# Altium project PCB_Project_IMX7.PrjPCB (part 5 of 9)

## Sheet IMX7S_CONNECTORS_&_IHM.SchDoc
size A2
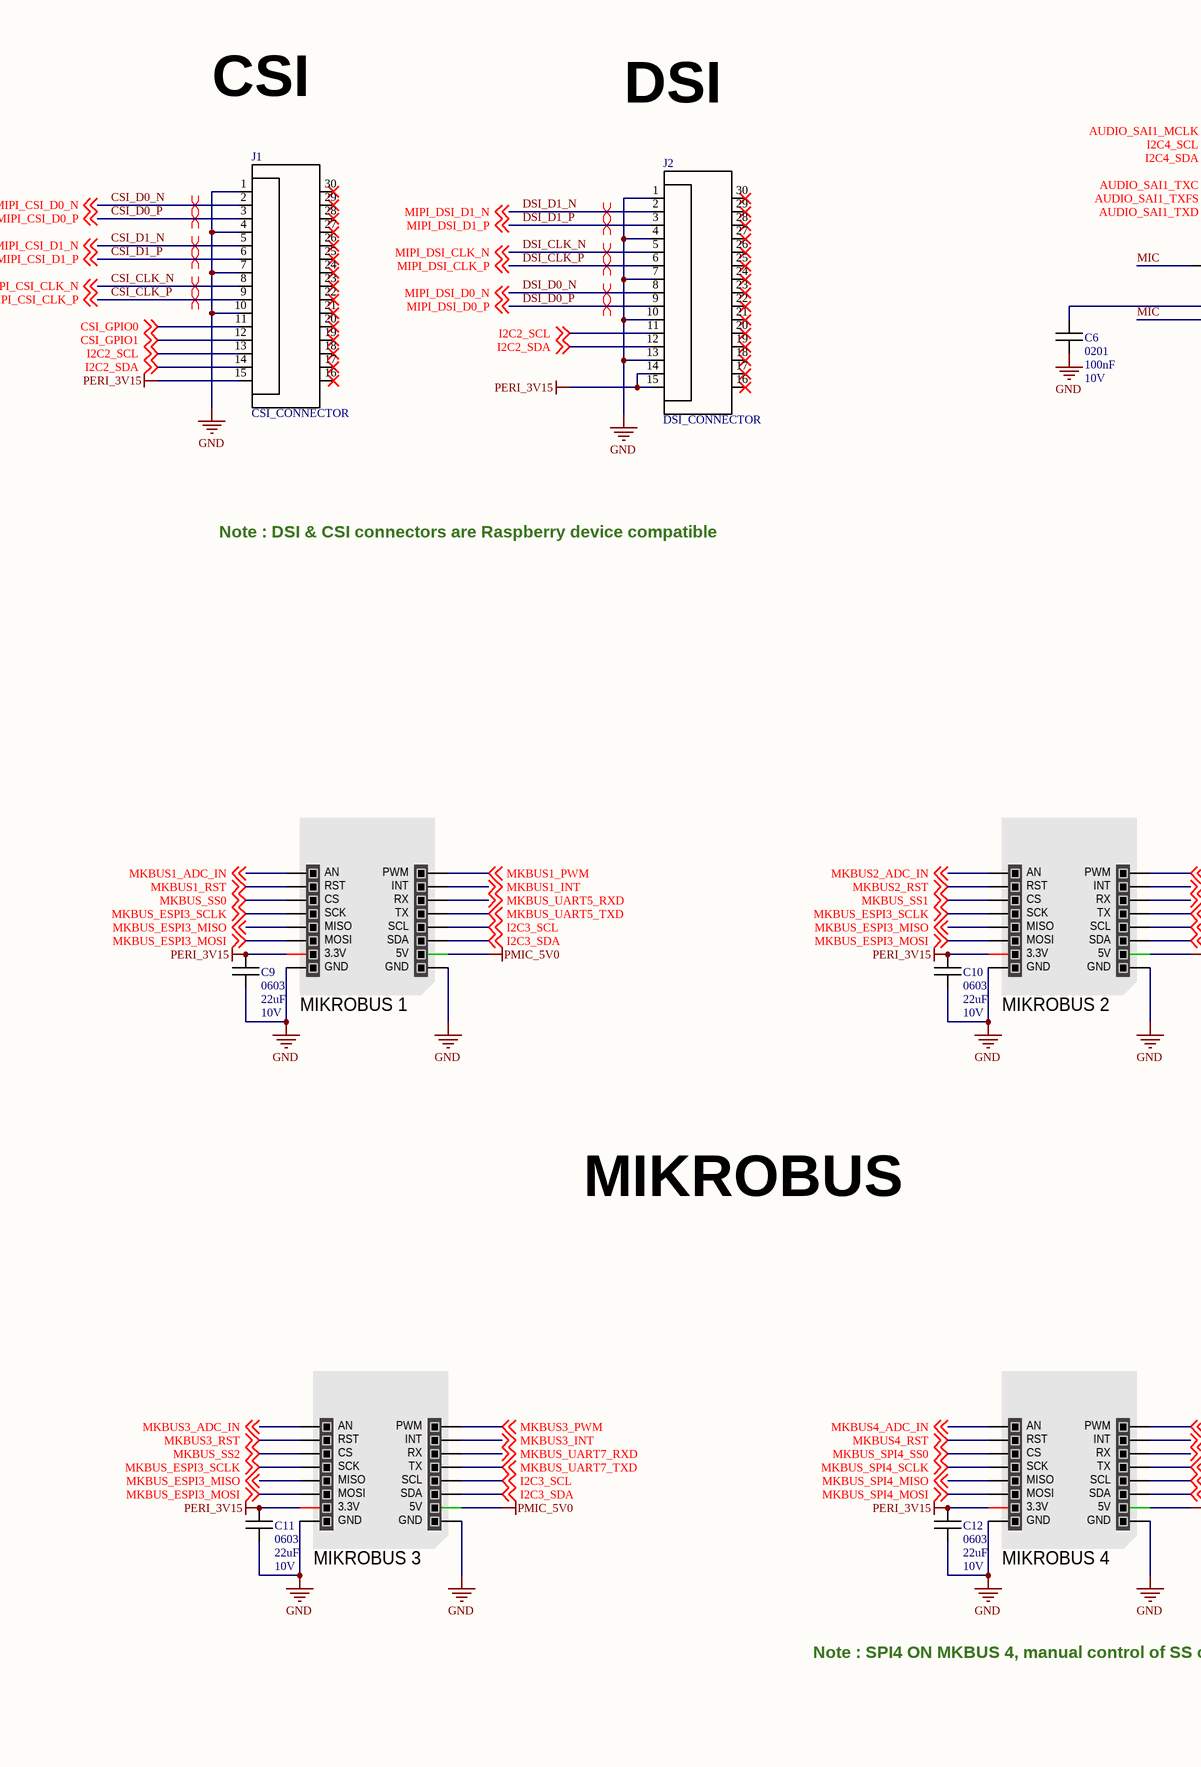
[diagram p7: IMX7S_CONNECTORS_&_IHM.SchDoc, left]
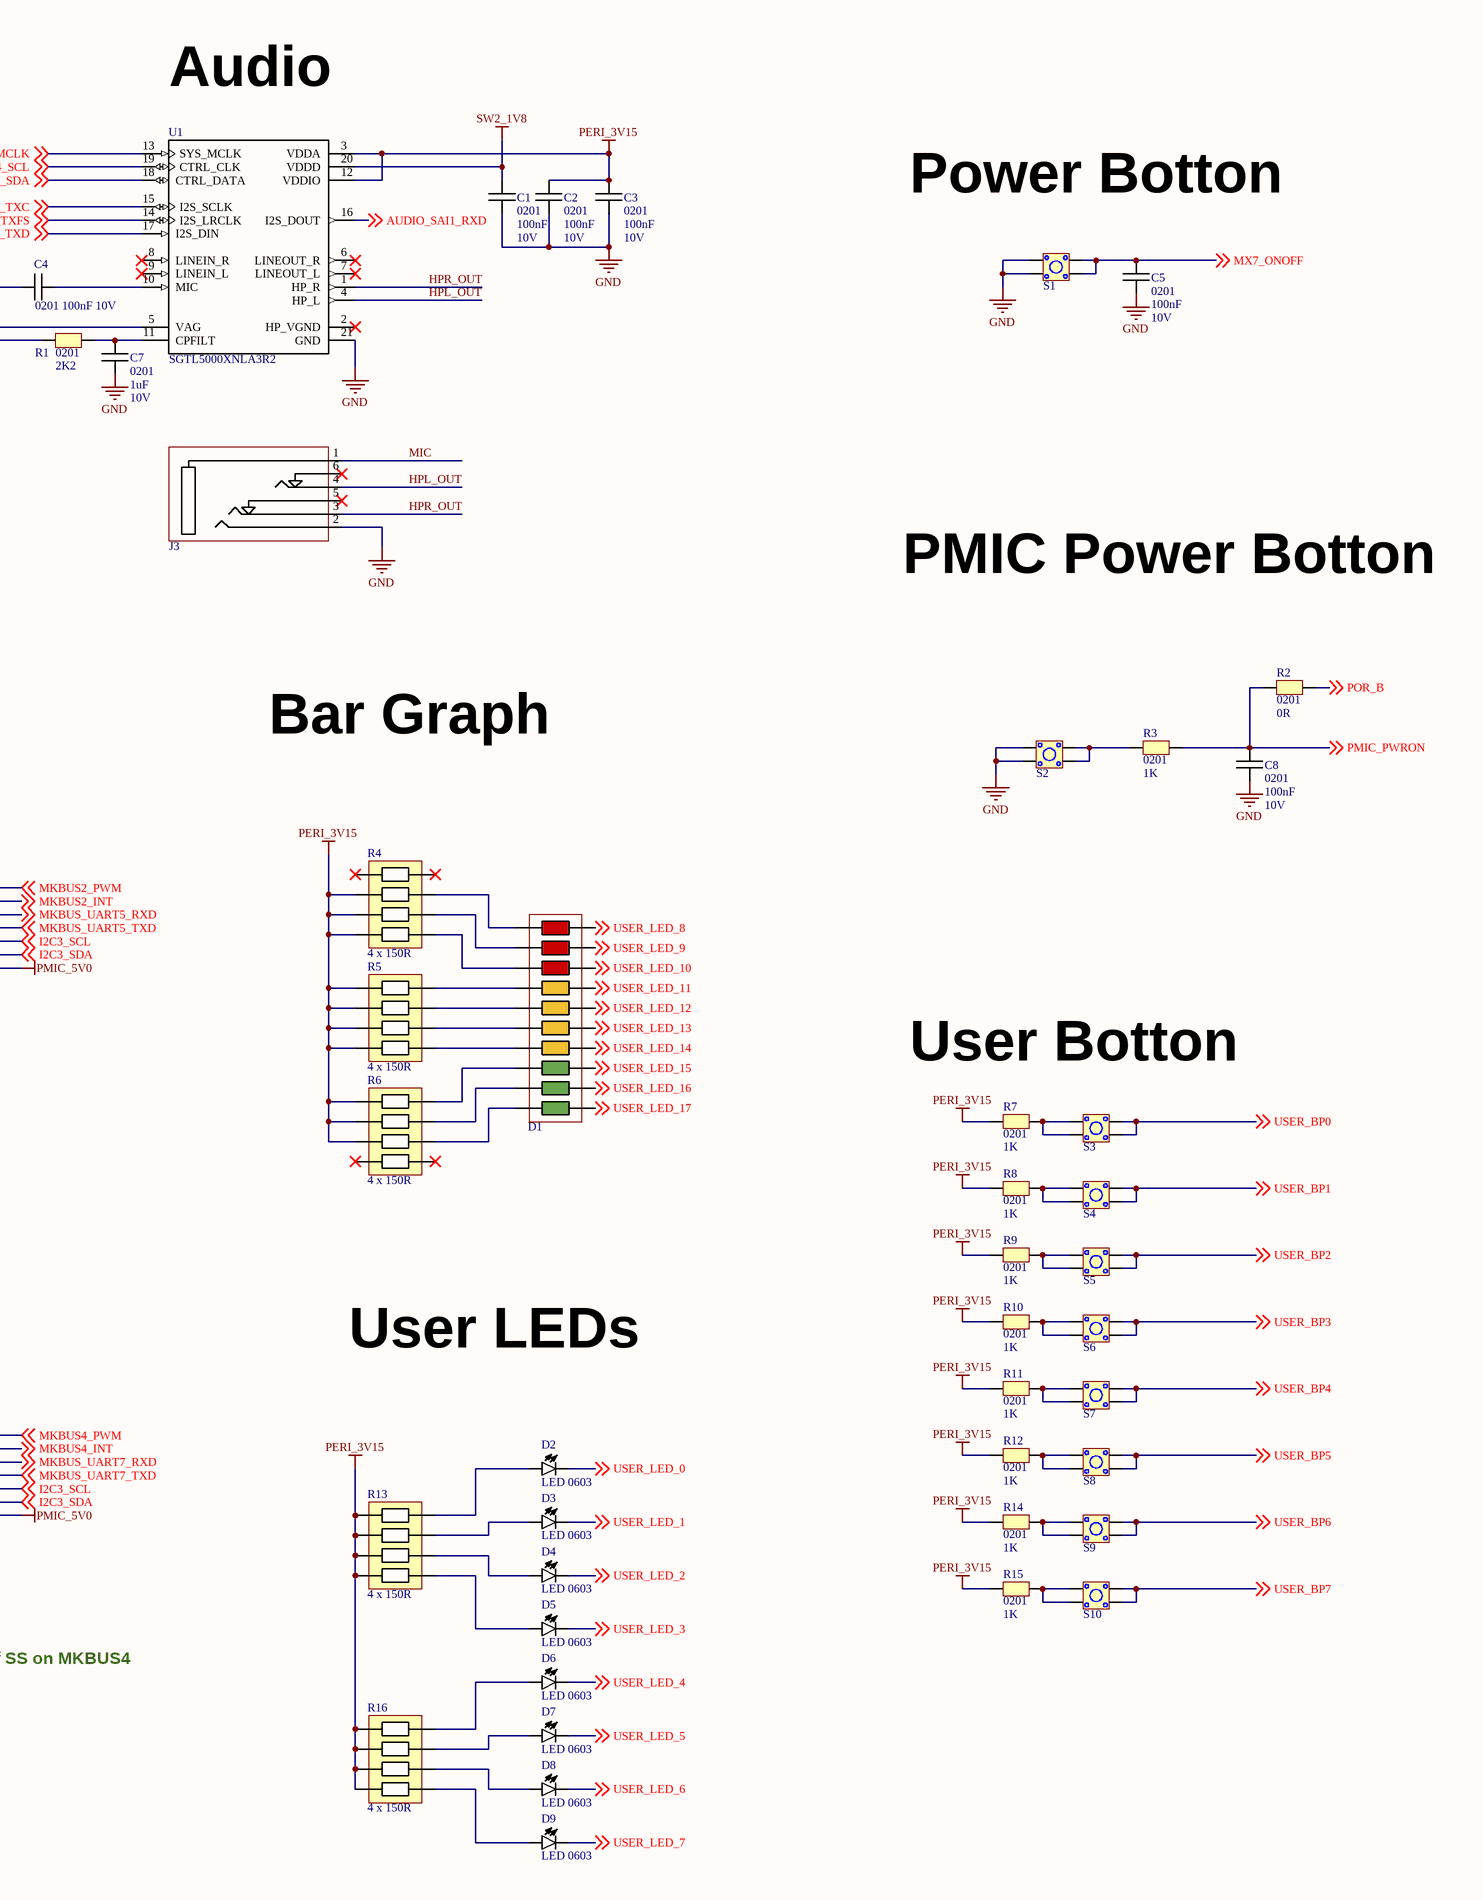
[diagram p8: IMX7S_CONNECTORS_&_IHM.SchDoc, right]

### Parts
C1  value 100nF  PACKAGE: 0201  VOLTAGE: 10V  [C0201]  (hidden comment: C0201)
C2  value 100nF  PACKAGE: 0201  VOLTAGE: 10V  [C0201]  (hidden comment: C0201)
C3  value 100nF  PACKAGE: 0201  VOLTAGE: 10V  [C0201]  (hidden comment: C0201)
C4  value 100nF  PACKAGE: 0201  VOLTAGE: 10V  [C0201]  (hidden comment: C0201)
C5  value 100nF  PACKAGE: 0201  VOLTAGE: 10V  [C0201]  (hidden comment: C0201)
C6  value 100nF  PACKAGE: 0201  VOLTAGE: 10V  [C0201]  (hidden comment: C0201)
C7  value 1uF  PACKAGE: 0201  VOLTAGE: 10V  [C0201]  (hidden comment: C0201)
C8  value 100nF  PACKAGE: 0201  VOLTAGE: 10V  [C0201]  (hidden comment: C0201)
C9  value 22uF  PACKAGE: 0603  VOLTAGE: 10V  [C0603]  (hidden comment: C0603)
C10  value 22uF  PACKAGE: 0603  VOLTAGE: 10V  [C0603]  (hidden comment: C0603)
C11  value 22uF  PACKAGE: 0603  VOLTAGE: 10V  [C0603]  (hidden comment: C0603)
C12  value 22uF  PACKAGE: 0603  VOLTAGE: 10V  [C0603]  (hidden comment: C0603)
D1  BARGRAPH  [BARGRAPH]  (value not drawn)
D2  LED 0603  [D0603]
D3  LED 0603  [D0603]
D4  LED 0603  [D0603]
D5  LED 0603  [D0603]
D6  LED 0603  [D0603]
D7  LED 0603  [D0603]
D8  LED 0603  [D0603]
D9  LED 0603  [D0603]
J1  CSI_CONNECTOR  [CSI_DSI]
J2  DSI_CONNECTOR  [CSI_DSI]
J3  JACK_AUDIO  [JACK_AUDIO]  (value not drawn)
MIKROBUS_1  MIKROBUS HOST CONN.  [MIKROBUS HOST CONN.]  (value not drawn)
MIKROBUS_2  MIKROBUS HOST CONN.  [MIKROBUS HOST CONN.]  (value not drawn)
MIKROBUS_3  MIKROBUS HOST CONN.  [MIKROBUS HOST CONN.]  (value not drawn)
MIKROBUS_4  MIKROBUS HOST CONN.  [MIKROBUS HOST CONN.]  (value not drawn)
R1  value 2K2  PACKAGE: 0201  [R0201]  (hidden comment: R0201)
R2  value 0R  PACKAGE: 0201  [R0201]  (hidden comment: R0201)
R3  value 1K  PACKAGE: 0201  [R0201]  (hidden comment: R0201)
R4  4 x 150R  [Reseau_R_1206]
R5  4 x 150R  [Reseau_R_1206]
R6  4 x 150R  [Reseau_R_1206]
R7  value 1K  PACKAGE: 0201  [R0201]  (hidden comment: R0201)
R8  value 1K  PACKAGE: 0201  [R0201]  (hidden comment: R0201)
R9  value 1K  PACKAGE: 0201  [R0201]  (hidden comment: R0201)
R10  value 1K  PACKAGE: 0201  [R0201]  (hidden comment: R0201)
R11  value 1K  PACKAGE: 0201  [R0201]  (hidden comment: R0201)
R12  value 1K  PACKAGE: 0201  [R0201]  (hidden comment: R0201)
R13  4 x 150R  [Reseau_R_1206]
R14  value 1K  PACKAGE: 0201  [R0201]  (hidden comment: R0201)
R15  value 1K  PACKAGE: 0201  [R0201]  (hidden comment: R0201)
R16  4 x 150R  [Reseau_R_1206]
S1  BP  [BP]  (value not drawn)
S2  BP  [BP]  (value not drawn)
S3  BP  [BP]  (value not drawn)
S4  BP  [BP]  (value not drawn)
S5  BP  [BP]  (value not drawn)
S6  BP  [BP]  (value not drawn)
S7  BP  [BP]  (value not drawn)
S8  BP  [BP]  (value not drawn)
S9  BP  [BP]  (value not drawn)
S10  BP  [BP]  (value not drawn)
U1  SGTL5000XNLA3R2  [QFN40P300X300X60-21N]

### Nets
GND: C1.1 C2.1 C3.1 C5.1 C6.1 C7.1 C8.1 C9.1 C10.1 C11.1 C12.1 J1.1 J1.4 J1.7 J1.10 J2.1 J2.4 J2.7 J2.10 J2.13 J3.2 MIKROBUS_1.8(GND) MIKROBUS_1.9(GND) MIKROBUS_2.8(GND) MIKROBUS_2.9(GND) MIKROBUS_3.8(GND) MIKROBUS_3.9(GND) MIKROBUS_4.8(GND) MIKROBUS_4.9(GND) S1.1 S1.2 S2.1 S2.2 U1.21(GND)
PERI_3V15: C2.2 C3.2 C9.2 C10.2 C11.2 C12.2 J1.15 J2.14 J2.15 MIKROBUS_1.7(3.3V) MIKROBUS_2.7(3.3V) MIKROBUS_3.7(3.3V) MIKROBUS_4.7(3.3V) R4.2 R4.3 R4.4 R5.1 R5.2 R5.3 R5.4 R6.1 R6.2 R6.3 R7.1 R8.1 R9.1 R10.1 R11.1 R12.1 R13.1 R13.2 R13.3 R13.4 R14.1 R15.1 R16.1 R16.2 R16.3 R16.4 U1.3(VDDA) U1.12(VDDIO)
PMIC_5V0: MIKROBUS_1.10(5V) MIKROBUS_2.10(5V) MIKROBUS_3.10(5V) MIKROBUS_4.10(5V)
SW2_1V8: C1.2 U1.20(VDDD)
AUDIO_SAI1_MCLK: U1.13(SYS_MCLK) ; off-sheet AUDIO_SAI1_MCLK
AUDIO_SAI1_RXD: U1.16(I2S_DOUT) ; off-sheet AUDIO_SAI1_RXD
AUDIO_SAI1_TXC: U1.15(I2S_SCLK) ; off-sheet AUDIO_SAI1_TXC
AUDIO_SAI1_TXD: U1.17(I2S_DIN) ; off-sheet AUDIO_SAI1_TXD
AUDIO_SAI1_TXFS: U1.14(I2S_LRCLK) ; off-sheet AUDIO_SAI1_TXFS
CSI_CLK_N: J1.8 ; off-sheet MIPI_CSI_CLK_N  [also labelled MIPI_CSI_CLK_N]
CSI_CLK_P: J1.9 ; off-sheet MIPI_CSI_CLK_P  [also labelled MIPI_CSI_CLK_P]
CSI_D0_N: J1.2 ; off-sheet MIPI_CSI_D0_N  [also labelled MIPI_CSI_D0_N]
CSI_D0_P: J1.3 ; off-sheet MIPI_CSI_D0_P  [also labelled MIPI_CSI_D0_P]
CSI_D1_N: J1.5 ; off-sheet MIPI_CSI_D1_N  [also labelled MIPI_CSI_D1_N]
CSI_D1_P: J1.6 ; off-sheet MIPI_CSI_D1_P  [also labelled MIPI_CSI_D1_P]
CSI_GPIO0: J1.11 ; off-sheet CSI_GPIO0
CSI_GPIO1: J1.12 ; off-sheet CSI_GPIO1
DSI_CLK_N: J2.5 ; off-sheet MIPI_DSI_CLK_N  [also labelled MIPI_DSI_CLK_N]
DSI_CLK_P: J2.6 ; off-sheet MIPI_DSI_CLK_P  [also labelled MIPI_DSI_CLK_P]
DSI_D0_N: J2.8 ; off-sheet MIPI_DSI_D0_N  [also labelled MIPI_DSI_D0_N]
DSI_D0_P: J2.9 ; off-sheet MIPI_DSI_D0_P  [also labelled MIPI_DSI_D0_P]
DSI_D1_N: J2.2 ; off-sheet MIPI_DSI_D1_N  [also labelled MIPI_DSI_D1_N]
DSI_D1_P: J2.3 ; off-sheet MIPI_DSI_D1_P  [also labelled MIPI_DSI_D1_P]
HPL_OUT: J3.4 U1.4(HP_L)
HPR_OUT: J3.3 U1.1(HP_R)
I2C2_SCL: J1.13 J2.11 ; off-sheet I2C2_SCL
I2C2_SDA: J1.14 J2.12 ; off-sheet I2C2_SDA
I2C3_SCL: MIKROBUS_1.12(SCL) MIKROBUS_2.12(SCL) MIKROBUS_3.12(SCL) MIKROBUS_4.12(SCL) ; off-sheet I2C3_SCL
I2C3_SDA: MIKROBUS_1.11(SDA) MIKROBUS_2.11(SDA) MIKROBUS_3.11(SDA) MIKROBUS_4.11(SDA) ; off-sheet I2C3_SDA
I2C4_SCL: U1.19(CTRL_CLK) ; off-sheet I2C4_SCL
I2C4_SDA: U1.18(CTRL_DATA) ; off-sheet I2C4_SDA
MIC: C4.1 J3.1 R1.1
MKBUS1_ADC_IN: MIKROBUS_1.1(AN) ; off-sheet MKBUS1_ADC_IN
MKBUS1_INT: MIKROBUS_1.15(INT) ; off-sheet MKBUS1_INT
MKBUS1_PWM: MIKROBUS_1.16(PWM) ; off-sheet MKBUS1_PWM
MKBUS1_RST: MIKROBUS_1.2(RST) ; off-sheet MKBUS1_RST
MKBUS2_ADC_IN: MIKROBUS_2.1(AN) ; off-sheet MKBUS2_ADC_IN
MKBUS2_INT: MIKROBUS_2.15(INT) ; off-sheet MKBUS2_INT
MKBUS2_PWM: MIKROBUS_2.16(PWM) ; off-sheet MKBUS2_PWM
MKBUS2_RST: MIKROBUS_2.2(RST) ; off-sheet MKBUS2_RST
MKBUS3_ADC_IN: MIKROBUS_3.1(AN) ; off-sheet MKBUS3_ADC_IN
MKBUS3_INT: MIKROBUS_3.15(INT) ; off-sheet MKBUS3_INT
MKBUS3_PWM: MIKROBUS_3.16(PWM) ; off-sheet MKBUS3_PWM
MKBUS3_RST: MIKROBUS_3.2(RST) ; off-sheet MKBUS3_RST
MKBUS4_ADC_IN: MIKROBUS_4.1(AN) ; off-sheet MKBUS4_ADC_IN
MKBUS4_INT: MIKROBUS_4.15(INT) ; off-sheet MKBUS4_INT
MKBUS4_PWM: MIKROBUS_4.16(PWM) ; off-sheet MKBUS4_PWM
MKBUS4_RST: MIKROBUS_4.2(RST) ; off-sheet MKBUS4_RST
MKBUS_ESPI3_MISO: MIKROBUS_1.5(MISO) MIKROBUS_2.5(MISO) MIKROBUS_3.5(MISO) ; off-sheet MKBUS_ESPI3_MISO
MKBUS_ESPI3_MOSI: MIKROBUS_1.6(MOSI) MIKROBUS_2.6(MOSI) MIKROBUS_3.6(MOSI) ; off-sheet MKBUS_ESPI3_MOSI
MKBUS_ESPI3_SCLK: MIKROBUS_1.4(SCK) MIKROBUS_2.4(SCK) MIKROBUS_3.4(SCK) ; off-sheet MKBUS_ESPI3_SCLK
MKBUS_SPI4_MISO: MIKROBUS_4.5(MISO) ; off-sheet MKBUS_SPI4_MISO  [project net CAN_SPI4_MISO]
MKBUS_SPI4_MOSI: MIKROBUS_4.6(MOSI) ; off-sheet MKBUS_SPI4_MOSI  [project net CAN_SPI4_MOSI]
MKBUS_SPI4_SCLK: MIKROBUS_4.4(SCK) ; off-sheet MKBUS_SPI4_SCLK  [project net CAN_SPI4_SCLK]
MKBUS_SPI4_SS0: MIKROBUS_4.3(CS) ; off-sheet MKBUS_SPI4_SS0
MKBUS_SS0: MIKROBUS_1.3(CS) ; off-sheet MKBUS_SS0
MKBUS_SS1: MIKROBUS_2.3(CS) ; off-sheet MKBUS_SS1
MKBUS_SS2: MIKROBUS_3.3(CS) ; off-sheet MKBUS_SS2
MKBUS_UART5_RXD: MIKROBUS_1.14(RX) MIKROBUS_2.14(RX) ; off-sheet MKBUS_UART5_RXD
MKBUS_UART5_TXD: MIKROBUS_1.13(TX) MIKROBUS_2.13(TX) ; off-sheet MKBUS_UART5_TXD
MKBUS_UART7_RXD: MIKROBUS_3.14(RX) MIKROBUS_4.14(RX) ; off-sheet MKBUS_UART7_RXD
MKBUS_UART7_TXD: MIKROBUS_3.13(TX) MIKROBUS_4.13(TX) ; off-sheet MKBUS_UART7_TXD
MX7_ONOFF: C5.2 S1.3 S1.4 ; off-sheet MX7_ONOFF
PMIC_PWRON: C8.2 R2.1 R3.2 ; off-sheet PMIC_PWRON
POR_B: R2.2 ; off-sheet POR_B
USER_BP0: S3.3 S3.4 ; off-sheet USER_BP0
USER_BP1: S4.3 S4.4 ; off-sheet USER_BP1
USER_BP2: S5.3 S5.4 ; off-sheet USER_BP2
USER_BP3: S6.3 S6.4 ; off-sheet USER_BP3
USER_BP4: S7.3 S7.4 ; off-sheet USER_BP4
USER_BP5: S8.3 S8.4 ; off-sheet USER_BP5
USER_BP6: S9.3 S9.4 ; off-sheet USER_BP6
USER_BP7: S10.3 S10.4 ; off-sheet USER_BP7
USER_LED_0: D2.2(K) ; off-sheet USER_LED_0
USER_LED_1: D3.2(K) ; off-sheet USER_LED_1
USER_LED_2: D4.2(K) ; off-sheet USER_LED_2
USER_LED_3: D5.2(K) ; off-sheet USER_LED_3
USER_LED_4: D6.2(K) ; off-sheet USER_LED_4
USER_LED_5: D7.2(K) ; off-sheet USER_LED_5
USER_LED_6: D8.2(K) ; off-sheet USER_LED_6
USER_LED_7: D9.2(K) ; off-sheet USER_LED_7
USER_LED_8: D1.20 ; off-sheet USER_LED_8
USER_LED_9: D1.19 ; off-sheet USER_LED_9
USER_LED_10: D1.18 ; off-sheet USER_LED_10
USER_LED_11: D1.17 ; off-sheet USER_LED_11
USER_LED_12: D1.16 ; off-sheet USER_LED_12
USER_LED_13: D1.15 ; off-sheet USER_LED_13
USER_LED_14: D1.14 ; off-sheet USER_LED_14
USER_LED_15: D1.13 ; off-sheet USER_LED_15
USER_LED_16: D1.12 ; off-sheet USER_LED_16
USER_LED_17: D1.11 ; off-sheet USER_LED_17
NetC4_2: C4.2 U1.10(MIC)
NetC6_2: C6.2 U1.5(VAG)
NetC7_2: C7.2 R1.2 U1.11(CPFILT)
NetD1_1: D1.1 R4.7
NetD1_2: D1.2 R4.6
NetD1_3: D1.3 R4.5
NetD1_4: D1.4 R5.8
NetD1_5: D1.5 R5.7
NetD1_6: D1.6 R5.6
NetD1_7: D1.7 R5.5
NetD1_8: D1.8 R6.8
NetD1_9: D1.9 R6.7
NetD1_10: D1.10 R6.6
NetD2_1: D2.1(A) R13.8
NetD3_1: D3.1(A) R13.7
NetD4_1: D4.1(A) R13.6
NetD5_1: D5.1(A) R13.5
NetD6_1: D6.1(A) R16.8
NetD7_1: D7.1(A) R16.7
NetD8_1: D8.1(A) R16.6
NetD9_1: D9.1(A) R16.5
NetR3_1: R3.1 S2.3 S2.4
NetR7_2: R7.2 S3.1 S3.2
NetR8_2: R8.2 S4.1 S4.2
NetR9_2: R9.2 S5.1 S5.2
NetR10_2: R10.2 S6.1 S6.2
NetR11_2: R11.2 S7.1 S7.2
NetR12_2: R12.2 S8.1 S8.2
NetR14_2: R14.2 S9.1 S9.2
NetR15_2: R15.2 S10.1 S10.2

Not connected (* = marked no-connect by the designer): J1 16* 17* 18* 19* 20* 21* 22* 23* 24* 25* 26* 27* 28* 29* 30*; J2 16* 17* 18* 19* 20* 21* 22* 23* 24* 25* 26* 27* 28* 29* 30*; J3 5* 6*; R4 1* 8*; R6 4* 5*; U1 2(HP_VGND)* 6(LINEOUT_R)* 7(LINEOUT_L)* 8(LINEIN_R)* 9(LINEIN_L)*

### Layout directives
differential pair: CSI_CLK_N, CSI_CLK_P, CSI_D0_N, CSI_D0_P, CSI_D1_N, CSI_D1_P, DSI_CLK_N, DSI_CLK_P, DSI_D0_N, DSI_D0_P, DSI_D1_N, DSI_D1_P

### Notes on the sheet
- CSI
- DSI
- Audio
- Power Botton
- Note : DSI & CSI connectors are Raspberry device compatible
- PMIC Power Botton
- Bar Graph
- User Botton
- MIKROBUS
- User LEDs
- Note : SPI4 ON MKBUS 4, manual control of SS on MKBUS4
- Title
- Size:
- Date:
- File:
- A2
- Number:
- Time:
- Revision:
- Sheet
- of

### Library data of the parts
C1-C6 C8 = C0201: Manufacturer 1: Murata; Manufacturer Part Number 1: GRM033R61A104KE15D; Description: CAP CER 0.1UF 10V X5R 0201; Dielectric: X5R; Tolerance: 10%; Supplier 1: Farnell; Supplier Part Number 1: 2666355; Stock 1: 2430000; Pricing 1: 15000=0,00510, 75000=0,00310 (EUR); RoHS: Yes; Mount: Surface Mount; Case/Package: 0201; Weight: 6E-06oz; Case Code (Metric): 0603; Case Code (Imperial): 0201; Min Operating Temperature: -55°C; Max Operating Temperature: 85°C; Packaging: Tape and Reel; Capacitance: 100nF; Package Quantity: 1; Voltage Rating (DC): 10V; Termination: SMD/SMT; Voltage Rating: 10V; Length: 0.6mm; Height: 0.3mm; Width: 0.012inch; Thickness: 0.013inch; Depth: 0.3mm; Radiation Hardening: No; REACH SVHC: No SVHC; Lead Free: Lead Free; ComponentLink1URL: https://datasheet.ciiva.com/26843/getdatasheetpartid-308656-26843739.pdf?src-supplier=Verical; ComponentLink1Description: https://datasheet.ciiva.com/26843/getdatasheetpartid-308656-26843739.pdf?src-supplier=Verical; ComponentLink2URL: https://datasheet.ciiva.com/5413/product-5413117.pdf?src-supplier=Mouser; ComponentLink2Description: https://datasheet.ciiva.com/5413/product-5413117.pdf?src-supplier=Mouser; ComponentLink3URL: https://datasheet.ciiva.com/6256/partnumbering-e-01-6256406.pdf?src-supplier=Digi-Key; ComponentLink3Description: https://datasheet.ciiva.com/6256/partnumbering-e-01-6256406.pdf?src-supplier=Digi-Key; ComponentLink4URL: https://datasheet.ciiva.com/6256/partnumbering-e-01-6256408.pdf?src-supplier=Digi-Key; ComponentLink4Description: https://datasheet.ciiva.com/6256/partnumbering-e-01-6256408.pdf?src-supplier=Digi-Key; ComponentLink5URL: https://datasheet.ciiva.com/6256/partnumbering-e-01-6256407.pdf?src-supplier=Digi-Key; ComponentLink5Description: https://datasheet.ciiva.com/6256/partnumbering-e-01-6256407.pdf?src-supplier=Digi-Key
C7 = C0201: Manufacturer 1: Murata; Manufacturer Part Number 1: GRM033R60J105MEA2D; Description: CAP CER 1UF 6.3V X5R 0201; Tolerance: 20%; Voltage Rating: 6.3V; Dielectric: X5R; Supplier 1: Farnell; Supplier Part Number 1: 2666353; Stock 1: 165000; Pricing 1: 15000=0,01430, 75000=0,01240 (EUR); RoHS: Yes; Mount: Surface Mount; Case/Package: 0201; Weight: 1.2E-05oz; Case Code (Imperial): 0201; Case Code (Metric): 0603; Min Operating Temperature: -55°C; Max Operating Temperature: 85°C; Package Quantity: 1; Packaging: Cut Tape; Capacitance: 1uF; Voltage Rating (DC): 6.3V; Termination: SMD/SMT; Length: 0.6mm; Height: 0.3mm; Width: 0.3mm; Depth: 0.3mm; Thickness: 300um; REACH SVHC: No SVHC; Lead Free: Lead Free; ComponentLink1URL: https://datasheet.ciiva.com/18699/grm033r60j105mea2-02-18699520.pdf?src-supplier=Digi-Key; ComponentLink1Description: https://datasheet.ciiva.com/18699/grm033r60j105mea2-02-18699520.pdf?src-supplier=Digi-Key; ComponentLink2URL: https://datasheet.ciiva.com/24218/c02e-24218376.pdf?src-supplier=Mouser; ComponentLink2Description: https://datasheet.ciiva.com/24218/c02e-24218376.pdf?src-supplier=Mouser; ComponentLink3URL: https://datasheet.ciiva.com/18699/partnumbering-e-01-18699519.pdf?src-supplier=Digi-Key; ComponentLink3Description: https://datasheet.ciiva.com/18699/partnumbering-e-01-18699519.pdf?src-supplier=Digi-Key
C9-C12 = C0603: Manufacturer 1: Murata; Manufacturer Part Number 1: GRM188R60J226MEA0D; Description: Cap Ceramic 22uF 6.3V X5R 20% SMD 0603 85C Paper T/R; Tolerance: 20%; Voltage Rating: 6.3V; Dielectric: X5R; Supplier 1: Farnell; Supplier Part Number 1: 2666490; Stock 1: 3840000; Pricing 1: 4000=0,03830, 20000=0,03750 (EUR); RoHS: Yes; Mount: Surface Mount; Case/Package: 0603; Weight: 0.000222oz; Case Code (Metric): 1608; Case Code (Imperial): 0603; Min Operating Temperature: -55°C; Max Operating Temperature: 85°C; Capacitance: 22uF; Packaging: Tape and Reel; Package Quantity: 4000; Termination: SMD/SMT; Voltage Rating (DC): 6.3V; Length: 1.6mm; Height: 0.8mm; Width: 0.8mm; Thickness: 0.039inch; Depth: 0.8mm; REACH SVHC: No SVHC; Lead Free: Lead Free; ComponentLink1URL: https://datasheet.ciiva.com/29540/partnumbering-e-01-29540443.pdf?src-supplier=Digi-Key; ComponentLink1Description: https://datasheet.ciiva.com/29540/partnumbering-e-01-29540443.pdf?src-supplier=Digi-Key; ComponentLink2URL: https://datasheet.ciiva.com/29540/partnumbering-e-01-29540441.pdf?src-supplier=Digi-Key; ComponentLink2Description: https://datasheet.ciiva.com/29540/partnumbering-e-01-29540441.pdf?src-supplier=Digi-Key; ComponentLink3URL: https://datasheet.ciiva.com/29540/partnumbering-e-01-29540442.pdf?src-supplier=Digi-Key; ComponentLink3Description: https://datasheet.ciiva.com/29540/partnumbering-e-01-29540442.pdf?src-supplier=Digi-Key
D1 = BARGRAPH: Manufacturer 1: Lumex; Manufacturer Part Number 1: SSA-LXH1025G8Y1I1D; Description: BAR GRAPH, 10LED, GREEN/YEL/RED - More Details; Color: Green,Red,Yellow; Luminous Intensity: 10mcd; Forward Current: 20mA; Forward Voltage: 2.2V; Power Rating: 105mW; Number of LEDs: 10; Supplier 1: Farnell; Supplier Part Number 1: 2062328; Stock 1: 100; Pricing 1: 1=4,38000, 10=3,27000, 25=2,74000, 50=2,42000, 100=2,09000, 500=1,68000 (EUR); RoHS: Yes; Illumination Color: Green,Red,Yellow; Package Quantity: 10; REACH SVHC: No SVHC; ComponentLink1URL: https://datasheet.ciiva.com/1238/ssa-lxh1025g8y1i1d-1238611.pdf?src-supplier=Element14; ComponentLink1Description: https://datasheet.ciiva.com/1238/ssa-lxh1025g8y1i1d-1238611.pdf?src-supplier=Element14; ComponentLink2URL: https://datasheet.ciiva.com/12082/ssa-lxh1025g8y1i1d-115447-12082982.pdf?src-supplier=Mouser; ComponentLink2Description: https://datasheet.ciiva.com/12082/ssa-lxh1025g8y1i1d-115447-12082982.pdf?src-supplier=Mouser; ComponentLink3URL: https://datasheet.ciiva.com/1241/ssa-lxh1025g8y1i1d-1241885.pdf?src-supplier=Farnell; ComponentLink3Description: https://datasheet.ciiva.com/1241/ssa-lxh1025g8y1i1d-1241885.pdf?src-supplier=Farnell
D2-D9 = LED: Manufacturer 1: Dialight; Manufacturer Part Number 1: 597-5112-407F; Description: LED RED DIFFUSED 0603 SMD; Color: Red; Lens Color: White; Luminous Intensity: 11.7mcd; Viewing Angle: 152°; Forward Voltage: 1.7V; Wavelength: 660nm; Lens Style: Rectangular,Diffused; Forward Current: 20mA; Lens Transparency: Diffused; Dominant Wavelength: 647nm; Number of Elements: 1; Power Dissipation: 57.5mW; Supplier 1: Farnell; Supplier Part Number 1: 2410206; Stock 1: 4000; Pricing 1: 4000=0,23100, 8000=0,22100, 16000=0,21300 (EUR); RoHS: Yes; Mount: Surface Mount; Case/Package: 0603; Number of Pins: 2; Case Code (Metric): 1608; Case Code (Imperial): 0603; Min Operating Temperature: -30°C; Max Operating Temperature: 85°C; Packaging: Tape and Reel; Package Quantity: 1; Illumination Color: Red; Test Current: 20mA; Voltage Rating (DC): 1.7V; Input Current: 20mA; Number of LEDs: 1; Length: 1.6mm; Height: 0.7mm; Width: 0.8mm; Depth: 0.8mm; Radiation Hardening: No; REACH SVHC: No SVHC; Lead Free: Lead Free; ComponentLink1URL: https://datasheet.ciiva.com/15117/getdatasheetpartid-87981-15117375.pdf?src-supplier=Verical; ComponentLink1Description: https://datasheet.ciiva.com/15117/getdatasheetpartid-87981-15117375.pdf?src-supplier=Verical; ComponentLink2URL: https://datasheet.ciiva.com/4688/c16413e-14555-4688795.pdf?src-supplier=Mouser; ComponentLink2Description: https://datasheet.ciiva.com/4688/c16413e-14555-4688795.pdf?src-supplier=Mouser; ComponentLink3URL: https://datasheet.ciiva.com/2111/c16413-2111592.pdf?src-supplier=Digi-Key; ComponentLink3Description: https://datasheet.ciiva.com/2111/c16413-2111592.pdf?src-supplier=Digi-Key; ComponentLink4URL: https://datasheet.ciiva.com/16214/597-xxxx-4xx-16214360.pdf?src-supplier=Future+Electronics; ComponentLink4Description: https://datasheet.ciiva.com/16214/597-xxxx-4xx-16214360.pdf?src-supplier=Future+Electronics; ComponentLink5URL: https://datasheet.ciiva.com/30210/597-xxxx-4xx-30210171.pdf?src-supplier=Onlinecomponents.com; ComponentLink5Description: https://datasheet.ciiva.com/30210/597-xxxx-4xx-30210171.pdf?src-supplier=Onlinecomponents.com; ComponentLink6URL: https://datasheet.ciiva.com/16011/597-xxxx-4xx-16011468.pdf?src-supplier=Onlinecomponents.com; ComponentLink6Description: https://datasheet.ciiva.com/16011/597-xxxx-4xx-16011468.pdf?src-supplier=Onlinecomponents.com; ComponentLink7URL: https://datasheet.ciiva.com/2111/c16413-2111593.pdf?src-supplier=Digi-Key; ComponentLink7Description: https://datasheet.ciiva.com/2111/c16413-2111593.pdf?src-supplier=Digi-Key; ComponentLink8URL: https://datasheet.ciiva.com/2111/c16413-2111594.pdf?src-supplier=Digi-Key; ComponentLink8Description: https://datasheet.ciiva.com/2111/c16413-2111594.pdf?src-supplier=Digi-Key
J1 J2 = CSI_DSI_CONN: Manufacturer 1: TE Connectivity; Manufacturer Part Number 1: 3-1734248-0; Description: TE CONNECTIVITY         3-1734248-0             FFC / FPC Board Connector, FPC Series, Surface Mount, Receptacle, 30 Contacts, 1 mm; Current Rating: 1A; Voltage Rating: 125V; Gender: Female; Number of Positions: 30; Contact Location: Bottom; Shielding: Unshielded; Connector Type: Receptacle,Connector,Socket; Wire/Cable Type: Flat Flex; Connector System: Flex-to-Board; Mating Alignment: Yes (With); PCB Mount Alignment: No (Without); PCB Mount Retention: With; PCB Mounting Orientation: Vertical; Pitch: 0.039inch; Supplier 1: Farnell; Supplier Part Number 1: 1816448; Stock 1: 572; Pricing 1: 1=1,22000, 50=1,19000, 100=1,16000, 250=1,04000, 500=0,96200, 1000=0,78700 (EUR); RoHS: Yes; Mount: Surface Mount; Contact Material: Bronze; Contact Plating: Gold; Housing Color: Black; Housing Material: Thermoplastic; Min Operating Temperature: -4°C; Max Operating Temperature: 185°C; Package Quantity: 1000; Packaging: Tape and Reel; Number of Rows: 1; Termination: SMD/SMT; Number of Contacts: 30; Orientation: Straight; Sealable: No (Without); Shrouded: Yes (With); Contact Current Rating: 1A; Length: 1.4724inch; Height: 7.7mm; Width: 4.6mm; Depth: 4.6mm; Radiation Hardening: No; REACH SVHC: Unknown; Lead Free: Lead Free; ELV: Compliant; Flammability Rating: UL94 V-0; ComponentLink1URL: https://datasheet.ciiva.com/672/eng-cd-1734248-e1-672689.pdf?src-supplier=Digi-Key; ComponentLink1Description: https://datasheet.ciiva.com/672/eng-cd-1734248-e1-672689.pdf?src-supplier=Digi-Key; ComponentLink2URL: https://datasheet.ciiva.com/672/eng-cd-1734248-e1-672690.pdf?src-supplier=Digi-Key; ComponentLink2Description: https://datasheet.ciiva.com/672/eng-cd-1734248-e1-672690.pdf?src-supplier=Digi-Key; ComponentLink3URL: https://datasheet.ciiva.com/1437/586796-1437802.pdf?src-supplier=Element14; ComponentLink3Description: https://datasheet.ciiva.com/1437/586796-1437802.pdf?src-supplier=Element14; ComponentLink4URL: https://datasheet.ciiva.com/672/eng-cd-1734248-e1-672691.pdf?src-supplier=Digi-Key; ComponentLink4Description: https://datasheet.ciiva.com/672/eng-cd-1734248-e1-672691.pdf?src-supplier=Digi-Key; ComponentLink5URL: https://datasheet.ciiva.com/15177/getdatasheetpartid-667727-15177063.pdf?src-supplier=Verical; ComponentLink5Description: https://datasheet.ciiva.com/15177/getdatasheetpartid-667727-15177063.pdf?src-supplier=Verical; ComponentLink6URL: https://datasheet.ciiva.com/10034/eng-ds-1-1773440-6-0506-10034555.pdf?src-supplier=Avnet; ComponentLink6Description: https://datasheet.ciiva.com/10034/eng-ds-1-1773440-6-0506-10034555.pdf?src-supplier=Avnet
MIKROBUS_1-MIKROBUS_4 = MIKROBUS HOST CONN._1: mikroBUS Host Socket; Manufacturer 1: Multicomp; Manufacturer Part Number 1: 2212S-08SG-85; Description: MULTICOMP         2212S-08SG-85            Board-To-Board Connector, 2212S Series, Through Hole, Receptacle, 8 Contacts, 2.54 mm; Gender: Receptacle; Number of Contacts: 8; Insulation Resistance: 1GR; SMD: No; Supplier 1: Farnell; Supplier Part Number 1: 1593463; Stock 1: 53350; Pricing 1: 15=0,18400, 150=0,13600, 500=0,11700, 1000=0,09550, 1500=0,09210, 5000=0,08870, 10000=0,08520, 20000=0,08180 (EUR); RoHS: Yes; Mount: Through Hole; Weight: 0.11lb; Contact Plating: Gold; Contact Material: Copper Alloy; Number of Rows: 1; Termination: Through Hole; Length: 0.83inch; Height: 0.35inch; Width: 0.12inch; REACH SVHC: No SVHC; Flammability Rating: UL94 V-0; ComponentLink1URL: https://datasheet.ciiva.com/1434/1662126-1434005.pdf?src-supplier=Element14; ComponentLink1Description: https://datasheet.ciiva.com/1434/1662126-1434005.pdf?src-supplier=Element14
R1 = R0201: Manufacturer 1: Panasonic; Manufacturer Part Number 1: ERJ-1GNF2201C; VOLTAGE: 0V; Description: RESISTOR, 0201, 0.05W, 1%, 2K2; Voltage Rating: 25V; Resistance: 2.2kR; Power Rating: 50mW; Tolerance: 1%; Temperature Coefficient: 200ppm/°C; Supplier 1: Farnell; Supplier Part Number 1: 2396891; Stock 1: 30000; Pricing 1: 15000=0,00650, 75000=0,00620 (EUR); RoHS: Yes; Mount: Surface Mount; Case/Package: 0201; Number of Pins: 2; Case Code (Metric): 0603; Case Code (Imperial): 0201; Min Operating Temperature: -55°C; Max Operating Temperature: 125°C; Packaging: Tape and Reel; Package Quantity: 15000; Composition: Thick Film; Number of Terminations: 2; Termination: SMD/SMT; Max Power Dissipation: 50mW; Voltage Rating (DC): 25V; Length: 0.6mm; Height: 0.01inch; Width: 0.012inch; Radiation Hardening: No; REACH SVHC: No SVHC; ComponentLink1URL: https://datasheet.ciiva.com/43467/1678782-43467062.pdf?src-supplier=Farnell; ComponentLink1Description: https://datasheet.ciiva.com/43467/1678782-43467062.pdf?src-supplier=Farnell; ComponentLink2URL: https://datasheet.ciiva.com/7830/1678782-7830712.pdf?src-supplier=Element14; ComponentLink2Description: https://datasheet.ciiva.com/7830/1678782-7830712.pdf?src-supplier=Element14; ComponentLink3URL: https://datasheet.ciiva.com/24069/aoa0000ce2-24069177.pdf?src-supplier=Mouser; ComponentLink3Description: https://datasheet.ciiva.com/24069/aoa0000ce2-24069177.pdf?src-supplier=Mouser; ComponentLink4URL: https://datasheet.ciiva.com/46375/1678782-46375117.pdf?src-supplier=Element14; ComponentLink4Description: https://datasheet.ciiva.com/46375/1678782-46375117.pdf?src-supplier=Element14
R2 = R0201: Manufacturer 1: Yageo; Manufacturer Part Number 1: RC0201JR-070RL; VOLTAGE: 0V; Description: RES SMD 0 OHM JUMPER 1/20W 0201; Resistance: 0mR; Power Rating: 50mW; Tolerance: 5%; Voltage Rating: 25V; Supplier 1: Farnell; Supplier Part Number 1: 1458895; Stock 1: 20130; Pricing 1: 10=0,03080, 100=0,01710, 500=0,00980, 2500=0,00800, 5000=0,00520 (EUR); RoHS: Yes; Case/Package: 0201; Weight: 6E-06oz; Case Code (Metric): 0603; Case Code (Imperial): 0201; Contact Plating: Tin,Matte; Min Operating Temperature: -55°C; Max Operating Temperature: 125°C; Packaging: Tape and Reel; Package Quantity: 10000; Composition: Thick Film; Number of Terminations: 2; Termination: SMD/SMT; Military Standard: Not; Max Power Dissipation: 50mW; Voltage Rating (DC): 25V; Features: Moisture Resistant; Length: 0.6mm; Height: 0.01inch; Width: 0.012inch; Depth: 0.3mm; Radiation Hardening: No; REACH SVHC: Unknown; Lead Free: Lead Free; ComponentLink1URL: https://datasheet.ciiva.com/7672/1563626-7672247.pdf?src-supplier=Element14; ComponentLink1Description: https://datasheet.ciiva.com/7672/1563626-7672247.pdf?src-supplier=Element14; ComponentLink2URL: https://datasheet.ciiva.com/7660/1421516-7660808.pdf?src-supplier=Element14; ComponentLink2Description: https://datasheet.ciiva.com/7660/1421516-7660808.pdf?src-supplier=Element14; ComponentLink3URL: https://datasheet.ciiva.com/7672/1563626-7672248.pdf?src-supplier=Element14; ComponentLink3Description: https://datasheet.ciiva.com/7672/1563626-7672248.pdf?src-supplier=Element14; ComponentLink4URL: https://datasheet.ciiva.com/16855/pyu-rc0201-51-rohs-l-8-16855994.pdf?src-supplier=Avnet+Europe; ComponentLink4Description: https://datasheet.ciiva.com/16855/pyu-rc0201-51-rohs-l-8-16855994.pdf?src-supplier=Avnet+Europe; ComponentLink5URL: https://datasheet.ciiva.com/28419/pyu-rc0201-51-rohs-l-8-28419660.pdf?src-supplier=Avnet+Europe; ComponentLink5Description: https://datasheet.ciiva.com/28419/pyu-rc0201-51-rohs-l-8-28419660.pdf?src-supplier=Avnet+Europe; ComponentLink6URL: https://datasheet.ciiva.com/46391/1421516-46391340.pdf?src-supplier=Element14; ComponentLink6Description: https://datasheet.ciiva.com/46391/1421516-46391340.pdf?src-supplier=Element14; ComponentLink7URL: https://datasheet.ciiva.com/8896/pyu-rc0201-51-rohs-l-8-8896143.pdf?src-supplier=Avnet; ComponentLink7Description: https://datasheet.ciiva.com/8896/pyu-rc0201-51-rohs-l-8-8896143.pdf?src-supplier=Avnet
R3 R7-R12 R14 R15 = R0201: Manufacturer 1: Vishay; Manufacturer Part Number 1: CRCW02011K00FNED; VOLTAGE: 0V; Description: RES SMD 1K OHM 1% 1/20W 0201; Resistance: 1kR; Power Rating: 50mW; Tolerance: 1%; Voltage Rating: 30V; Temperature Coefficient: 200ppm/°C; Supplier 1: Farnell; Supplier Part Number 1: 2140065; Stock 1: 61374; Pricing 1: 10=0,02460, 100=0,01890, 500=0,01370, 2500=0,00940, 5000=0,00720 (EUR); RoHS: Yes; Mount: Surface Mount; Case/Package: 0201; Number of Pins: 2; Weight: 6E-06oz; Case Code (Metric): 0603; Case Code (Imperial): 0201; Contact Plating: Tin; Min Operating Temperature: -55°C; Max Operating Temperature: 155°C; Packaging: Tape and Reel; Package Quantity: 1; Composition: Thick Film; Number of Terminations: 2; Termination: SMD/SMT; Military Standard: Not; Max Power Dissipation: 50mW; Voltage Rating (DC): 30V; Length: 0.6mm; Height: 0.011inch; Width: 0.012inch; Depth: 0.3mm; Radiation Hardening: No; REACH SVHC: Unknown; Lead Free: Lead Free; ComponentLink1URL: https://datasheet.ciiva.com/2474/crcw0201e3-2474800.pdf?src-supplier=Digi-Key; ComponentLink1Description: https://datasheet.ciiva.com/2474/crcw0201e3-2474800.pdf?src-supplier=Digi-Key; ComponentLink2URL: https://datasheet.ciiva.com/2474/crcw0201e3-2474801.pdf?src-supplier=Digi-Key; ComponentLink2Description: https://datasheet.ciiva.com/2474/crcw0201e3-2474801.pdf?src-supplier=Digi-Key; ComponentLink3URL: https://datasheet.ciiva.com/2474/crcw0201e3-2474802.pdf?src-supplier=Digi-Key; ComponentLink3Description: https://datasheet.ciiva.com/2474/crcw0201e3-2474802.pdf?src-supplier=Digi-Key; ComponentLink4URL: https://datasheet.ciiva.com/3255/crcw0201e3-3255929.pdf?src-supplier=Avnet; ComponentLink4Description: https://datasheet.ciiva.com/3255/crcw0201e3-3255929.pdf?src-supplier=Avnet; ComponentLink5URL: https://datasheet.ciiva.com/22665/1825492-22665818.pdf?src-supplier=Element14; ComponentLink5Description: https://datasheet.ciiva.com/22665/1825492-22665818.pdf?src-supplier=Element14; ComponentLink6URL: https://datasheet.ciiva.com/7983/1719906-7983323.pdf?src-supplier=Element14; ComponentLink6Description: https://datasheet.ciiva.com/7983/1719906-7983323.pdf?src-supplier=Element14; ComponentLink7URL: https://datasheet.ciiva.com/7983/1719906-7983324.pdf?src-supplier=Element14; ComponentLink7Description: https://datasheet.ciiva.com/7983/1719906-7983324.pdf?src-supplier=Element14; ComponentLink8URL: https://datasheet.ciiva.com/22871/70202042-22871422.pdf?src-supplier=Allied+Electronics; ComponentLink8Description: https://datasheet.ciiva.com/22871/70202042-22871422.pdf?src-supplier=Allied+Electronics; ComponentLink9URL: https://datasheet.ciiva.com/22692/1719906-22692751.pdf?src-supplier=Element14; ComponentLink9Description: https://datasheet.ciiva.com/22692/1719906-22692751.pdf?src-supplier=Element14
R4-R6 R13 R16 = Reseau_res: Manufacturer 1: Bourns; Manufacturer Part Number 1: CAY16-151J4LF; Voltage Rating: 50V; Number of Elements: 4; Power Rating: 248mW; Tolerance: 5%; Circuit Type: Isolated; Power Per Element: 62.5mW; Temperature Coefficient: 200ppm/°C; Supplier 1: Farnell; Supplier Part Number 1: 2321741; Stock 1: 11414; Pricing 1: 10=0,06620, 100=0,05150, 500=0,04090, 1000=0,03560, 2500=0,03160, 5000=0,02900, 25000=0,02070 (EUR); RoHS: Yes; Mount: Surface Mount; Case/Package: 1206; Number of Pins: 8; Case Code (Metric): 3216; Case Code (Imperial): 1206; Number of Terminals: 8; Contact Plating: Tin; Min Operating Temperature: -55°C; Max Operating Temperature: 125°C; Resistance: 150R; Package Quantity: 5000; Packaging: Tape and Reel; Number of Resistors: 4; Termination: Convex; Military Standard: Not; Voltage Rating (DC): 50V; Number of Circuits: 4; Length: 3.2mm; Height: 0.024inch; Width: 0.063inch; Terminal Pitch: 0.8mm; Depth: 1.6mm; Radiation Hardening: No; REACH SVHC: No SVHC; ComponentLink1URL: https://datasheet.ciiva.com/11807/0900766b8064e462-11807188.pdf?src-supplier=RSComponents; ComponentLink1Description: https://datasheet.ciiva.com/11807/0900766b8064e462-11807188.pdf?src-supplier=RSComponents; ComponentLink2URL: https://datasheet.ciiva.com/14583/70155479-14583402.pdf?src-supplier=Allied+Electronics; ComponentLink2Description: https://datasheet.ciiva.com/14583/70155479-14583402.pdf?src-supplier=Allied+Electronics; ComponentLink3URL: https://datasheet.ciiva.com/3264/catcay-3264859.pdf?src-supplier=Avnet; ComponentLink3Description: https://datasheet.ciiva.com/3264/catcay-3264859.pdf?src-supplier=Avnet
S1-S10 = BP: Manufacturer: TE Connectivity (Tyco Electronics); Manufacturer Part Number: 1-1825027-4; Manufacturer 1: Schurter; Manufacturer Part Number 1: 1301.9320.24; Actuator Color: Ivory; Actuator Length: 3.55 mm; Body Orientation: Right Angle; Actuator Style: Round Button; Ground Terminal: No; Electrical Life: 100000 Cycles; Dielectric Strength: 500 VAC; Contact Rating @ Voltage: 0.05@24VDC A; Maximum DC Voltage Rating: 24 V; Pole Throw Configuration: SPST; Illumination Type: N/R; Maximum Contact Resistance: 100 mOhm; Operating Force: 1.57 N; Switch Configuration: OFF (ON); Description: Switch Tactile N.O. SPST Round Button Gull Wing 0.05A 12VDC 100000Cycles 1.6N SMD T/R; Max Current Rating: 50mA; Voltage Rating (DC): 12V; Contact Material: Copper Alloy; Base Material: N/A; Family: 1825027; Contact Plating: Silver; Housing Material: N/A; Dimension: 7.11 x 10.16 x 7.01 mm; Part No: 1-1825027-4; RoHS: Yes; Maximum AC Voltage Rating: N/A; Seal Description: N/A; Mechanical Life: N/A; Packaging: Loose Piece; Product Weight: N/A; Mounting: Through Hole,PC Pins; Minimum Insulation Resistance: 100 MOhm; Operating Temperature: -35 to 85 C; Type: Micro-Miniature; Seal Location: N/A; ComponentLink1URL: https://datasheet.ciiva.com/8164/eng-cd-1825027-g4-8164816.pdf; ComponentLink1Description: https://datasheet.ciiva.com/8164/eng-cd-1825027-g4-8164816.pdf; ComponentLink2URL: https://datasheet.ciiva.com/17550/eng-cd-1825027-g4-17550604.pdf; ComponentLink2Description: https://datasheet.ciiva.com/17550/eng-cd-1825027-g4-17550604.pdf; Supplier 1: Farnell; Supplier Part Number 1: 2913817; Stock 1: 60; Pricing 1: 5=0,15300 (EUR); Mount: Surface Mount; Case/Package: SMD/SMT; Min Operating Temperature: -20°C; Max Operating Temperature: 70°C; Throw Configuration: SPST; Max Voltage Rating (DC): 12V; Termination: Gull Wing; Orientation: Straight; Length: 6mm; Depth: 10mm; Radiation Hardening: No; ComponentLink3URL: https://datasheet.ciiva.com/15183/getdatasheetpartid-466070-15183818.pdf?src-supplier=Verical; ComponentLink3Description: https://datasheet.ciiva.com/15183/getdatasheetpartid-466070-15183818.pdf?src-supplier=Verical; ComponentLink4URL: https://datasheet.ciiva.com/16696/typ-lsg-16696698.pdf?src-supplier=Avnet+Europe; ComponentLink4Description: https://datasheet.ciiva.com/16696/typ-lsg-16696698.pdf?src-supplier=Avnet+Europe
U1 = SGTL5000XNLA3R2: Audio Codec , Ultra Low-Power, 4 mw for DAC-to-HP, 98 dB SNR and -80 dB THD+N, QFN 32, Reel; MF: NXP USA; Digi-Key_Part_Number: 568-13255-1-ND; Digi-Key_Purchase_URL: https://www.digikey.com/product-detail/en/nxp-usa-inc/SGTL5000XNLA3R2/568-13255-1-ND/6576159?utm_source=snapeda&utm_medium=aggregator&utm_campaign=symbol; SnapEDA_Link: https://www.snapeda.com/parts/SGTL5000XNLA3R2/NXP%20USA%20Inc./view-part/?ref=snap; Package: QFN-20 NXP Semiconductors; MP: SGTL5000XNLA3R2; Value: *
J3 = JACK_AUDIO: Supplier 1: Farnell; Supplier Part Number 1: 2613992